# EAGLE design BPM7004_RetroCade_Synth_MegaWing (EAGLE 6.3)
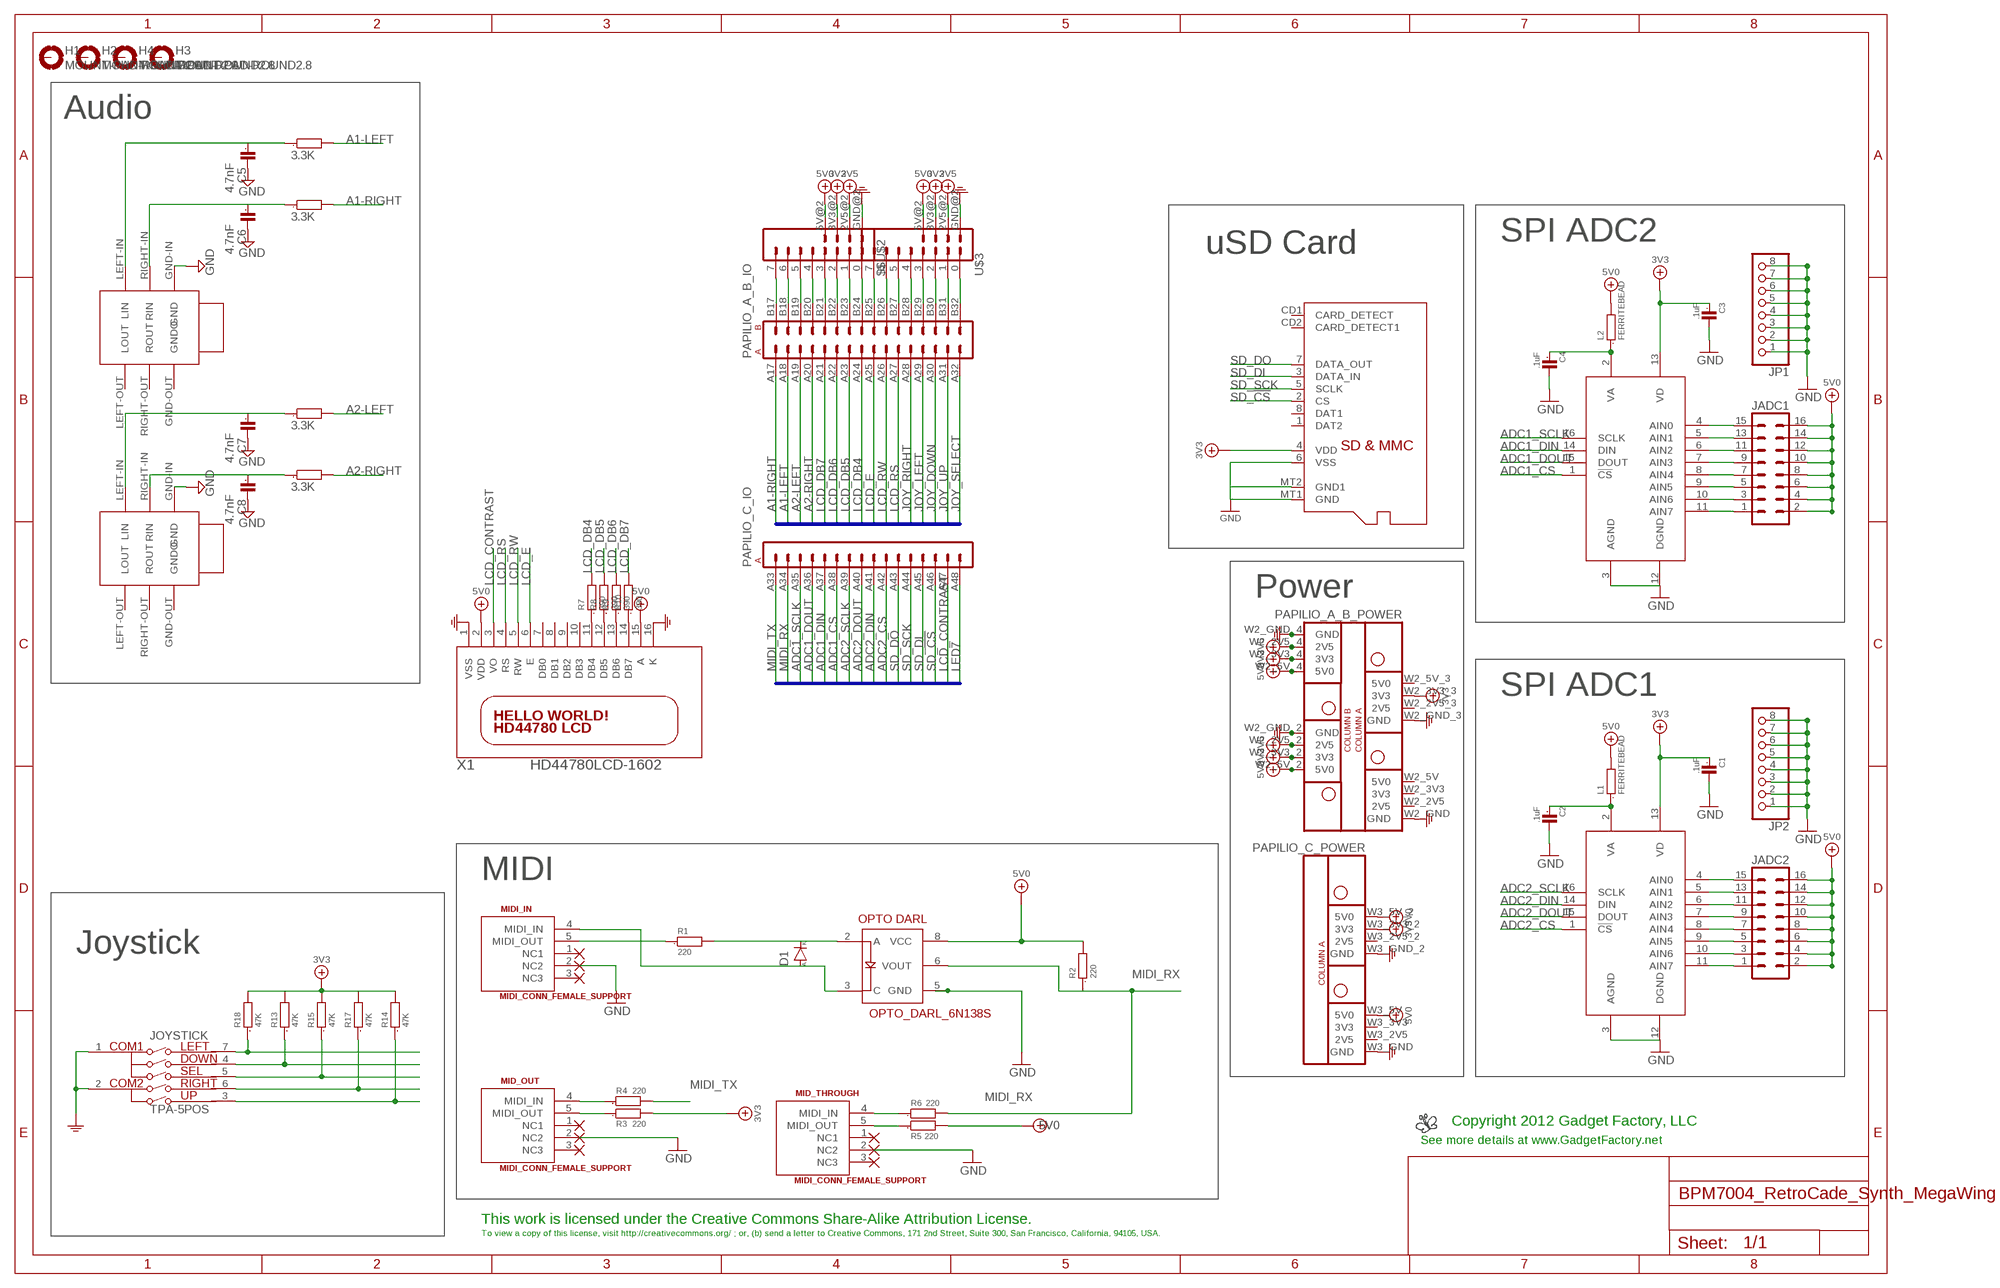
[diagram p0: schematic, sheet 1]

## Parts
$$U$1  OPTO_DARL_6N138S  [8-SMD]
$$U$2  WING8WING8_NOHOLES  [WINGSIDE_8BIT_NOHOLES]
A1  NMJ6HFD2  [NMJ6HFD2]
A2  NMJ6HFD2  [NMJ6HFD2]
ADC1  ADC088S102CIMT  [TSSOP16]
ADC2  ADC088S102CIMT  [TSSOP16]
C1  .1uF  C0603  [0603]
C2  .1uF  C0603  [0603]
C3  .1uF  C0603  [0603]
C4  .1uF  C0603  [0603]
C5  4.7nF  C0603  [0603]
C6  4.7nF  C0603  [0603]
C7  4.7nF  C0603  [0603]
C8  4.7nF  C0603  [0603]
D1  DIODE_SOD323  [SOD323]
H1  MOUNT-PAD-ROUND2.8  [2,8-PAD]
H2  MOUNT-PAD-ROUND2.8  [2,8-PAD]
H3  MOUNT-PAD-ROUND2.8  [2,8-PAD]
H4  MOUNT-PAD-ROUND2.8  [2,8-PAD]
JADC1  MA08-2  [MA08-2]
JADC2  MA08-2  [MA08-2]
JOYSTICK  TPA-5POS  [TPA-5POS]
JP1  PINHD-1X8  [1X08]
JP2  PINHD-1X8  [1X08]
L1  FERRITEBEAD  R0603  [0603]
L2  FERRITEBEAD  R0603  [0603]
LOGO1  BUTTERFLY_LOGO  [BUTTERFLY_LOGO]
MID_OUT  MIDI_CONN_FEMALE_SUPPORT  [DIN_5_FEMALE_SUPPORT]
MID_THROUGH  MIDI_CONN_FEMALE_SUPPORT  [DIN_5_FEMALE_SUPPORT]
MIDI_IN  MIDI_CONN_FEMALE_SUPPORT  [DIN_5_FEMALE_SUPPORT]
PAPILIO_  MEGAWING_FULL_P1MEGAWING_P1  [MEGAWING_FULL_NOHOLES_P1]
R1  220  R0603  [0603]
R2  220  R0603  [0603]
R3  220  R0603  [0603]
R4  220  R0603  [0603]
R5  220  R0603  [0603]
R6  220  R0603  [0603]
R7  390  R0603  [0603]
R8  390  R0603  [0603]
R9  390  R0603  [0603]
R10  390  R0603  [0603]
R11  3.3K  R0603  [0603]
R12  3.3K  R0603  [0603]
R13  47K  R0603  [0603]
R14  47K  R0603  [0603]
R15  47K  R0603  [0603]
R16  3.3K  R0603  [0603]
R17  47K  R0603  [0603]
R18  47K  R0603  [0603]
R19  3.3K  R0603  [0603]
SD1  MICROSD  [MICROSD]
U$3  WING8WING8_NOHOLES  [WINGSIDE_8BIT_NOHOLES]
X1  HD44780LCD-1602  [LCD1602]

## Nets
3V3: ADC1.13(VD) ADC2.13(VD) C1.1 C3.1 PAPILIO_.W2_3V3_3(A_B_POWER:3V3) PAPILIO_.W3_3V3_2(C_POWER:3V3) R3.2 R13.2 R14.2 R15.2 R17.2 R18.2 SD1.4(VDD)
5V0: $$U$1.8(VCC) JADC1.2 JADC1.4 JADC1.6 JADC1.8 JADC1.10 JADC1.12 JADC1.14 JADC1.16 JADC2.2 JADC2.4 JADC2.6 JADC2.8 JADC2.10 JADC2.12 JADC2.14 JADC2.16 L1.2 L2.2 PAPILIO_.W3_5V(C_POWER:5V0) PAPILIO_.W3_5V_2(C_POWER:5V0) R2.2 R5.2 X1.2(VDD) X1.15(A)
A1-LEFT: PAPILIO_.A18(A_B_IO:A2) R11.2
A1-RIGHT: PAPILIO_.A17(A_B_IO:A1) R12.2
A2-LEFT: PAPILIO_.A19(A_B_IO:A3) R16.2
A2-RIGHT: PAPILIO_.A20(A_B_IO:A4) R19.2
ADC1_CS: ADC2.1(!CS) PAPILIO_.A38(C_IO:A6)
ADC1_DIN: ADC2.14(DIN) PAPILIO_.A37(C_IO:A5)
ADC1_DOUT: ADC2.15(DOUT) PAPILIO_.A36(C_IO:A4)
ADC1_SCLK: ADC2.16(SCLK) PAPILIO_.A35(C_IO:A3)
ADC2_CS: ADC1.1(!CS) PAPILIO_.A42(C_IO:A10)
ADC2_DIN: ADC1.14(DIN) PAPILIO_.A41(C_IO:A9)
ADC2_DOUT: ADC1.15(DOUT) PAPILIO_.A40(C_IO:A8)
ADC2_SCLK: ADC1.16(SCLK) PAPILIO_.A39(C_IO:A7)
GND: $$U$1.5(GND) A1.GND-IN(GND) A2.GND-IN(GND) ADC1.3(AGND) ADC1.12(DGND) ADC2.3(AGND) ADC2.12(DGND) C1.2 C2.2 C3.2 C4.2 C5.2 C6.2 C7.2 C8.2 JOYSTICK.1(COM1) JOYSTICK.2(COM2) JP1.1 JP1.2 JP1.3 JP1.4 JP1.5 JP1.6 JP1.7 JP1.8 JP2.1 JP2.2 JP2.3 JP2.4 JP2.5 JP2.6 JP2.7 JP2.8 MID_OUT.2(NC2) MID_THROUGH.2(NC2) MIDI_IN.2(NC2) PAPILIO_.W2_GND(A_B_POWER:GND) PAPILIO_.W2_GND_3(A_B_POWER:GND) PAPILIO_.W3_GND(C_POWER:GND) PAPILIO_.W3_GND_2(C_POWER:GND) SD1.6(VSS) SD1.MT1(GND) SD1.MT2(GND1) X1.1(VSS) X1.16(K) ; supply symbol labelled AGND
JOY_DOWN: JOYSTICK.4(DOWN) PAPILIO_.A30(A_B_IO:A14) R13.1
JOY_LEFT: JOYSTICK.7(LEFT) PAPILIO_.A29(A_B_IO:A13) R18.1
JOY_RIGHT: JOYSTICK.6(RIGHT) PAPILIO_.A28(A_B_IO:A12) R17.1
JOY_SELECT: JOYSTICK.5(SELECT) PAPILIO_.A32(A_B_IO:A16) R15.1
JOY_UP: JOYSTICK.3(UP) PAPILIO_.A31(A_B_IO:A15) R14.1
LCD_CONTRAST: PAPILIO_.A47(C_IO:A15) X1.3(VO)
LCD_DB4: PAPILIO_.A24(A_B_IO:A8) R7.2
LCD_DB5: PAPILIO_.A23(A_B_IO:A7) R8.2
LCD_DB6: PAPILIO_.A22(A_B_IO:A6) R9.2
LCD_DB7: PAPILIO_.A21(A_B_IO:A5) R10.2
LCD_E: PAPILIO_.A25(A_B_IO:A9) X1.6(E)
LCD_RS: PAPILIO_.A27(A_B_IO:A11) X1.4(RS)
LCD_RW: PAPILIO_.A26(A_B_IO:A10) X1.5(RW)
LED7: PAPILIO_.A48(C_IO:A16)
MIDI_RX: $$U$1.6(VOUT) PAPILIO_.A34(C_IO:A2) R2.1 R6.2
MIDI_TX: PAPILIO_.A33(C_IO:A1) R4.2
N$1: MIDI_IN.5(MIDI_OUT) R1.1
N$2: $$U$1.3(C) D1.A MIDI_IN.4(MIDI_IN)
N$3: $$U$1.2(A) D1.K R1.2
N$4: A1.RIGHT-IN(RIN) C6.1 R12.1
N$5: MID_OUT.4(MIDI_IN) R4.1
N$6: ADC2.2(VA) C4.1 L2.1
N$7: MID_OUT.5(MIDI_OUT) R3.1
N$8: ADC2.11(AIN7) JADC1.1
N$9: ADC2.10(AIN6) JADC1.3
N$10: ADC2.9(AIN5) JADC1.5
N$11: ADC2.8(AIN4) JADC1.7
N$12: ADC2.7(AIN3) JADC1.9
N$13: ADC2.6(AIN2) JADC1.11
N$14: ADC2.5(AIN1) JADC1.13
N$15: ADC2.4(AIN0) JADC1.15
N$16: A1.LEFT-IN(LIN) C5.1 R11.1
N$17: A2.RIGHT-IN(RIN) C8.1 R19.1
N$18: A2.LEFT-IN(LIN) C7.1 R16.1
N$19: MID_THROUGH.4(MIDI_IN) R6.1
N$20: MID_THROUGH.5(MIDI_OUT) R5.1
N$24: R7.1 X1.11(DB4)
N$25: R8.1 X1.12(DB5)
N$26: R9.1 X1.13(DB6)
N$27: R10.1 X1.14(DB7)
N$37: ADC1.2(VA) C2.1 L1.1
N$39: ADC1.11(AIN7) JADC2.1
N$40: ADC1.10(AIN6) JADC2.3
N$41: ADC1.9(AIN5) JADC2.5
N$42: ADC1.8(AIN4) JADC2.7
N$43: ADC1.7(AIN3) JADC2.9
N$44: ADC1.6(AIN2) JADC2.11
N$45: ADC1.5(AIN1) JADC2.13
N$46: ADC1.4(AIN0) JADC2.15
N$160: $$U$2.7 PAPILIO_.B17(A_B_IO:B1)
N$161: $$U$2.6 PAPILIO_.B18(A_B_IO:B2)
N$162: $$U$2.5 PAPILIO_.B19(A_B_IO:B3)
N$163: $$U$2.4 PAPILIO_.B20(A_B_IO:B4)
N$164: $$U$2.3 PAPILIO_.B21(A_B_IO:B5)
N$165: $$U$2.2 PAPILIO_.B22(A_B_IO:B6)
N$166: $$U$2.1 PAPILIO_.B23(A_B_IO:B7)
N$167: $$U$2.0 PAPILIO_.B24(A_B_IO:B8)
N$168: PAPILIO_.B25(A_B_IO:B9) U$3.7
N$169: PAPILIO_.B26(A_B_IO:B10) U$3.6
N$170: PAPILIO_.B27(A_B_IO:B11) U$3.5
N$171: PAPILIO_.B28(A_B_IO:B12) U$3.4
N$172: PAPILIO_.B29(A_B_IO:B13) U$3.3
N$173: PAPILIO_.B30(A_B_IO:B14) U$3.2
N$174: PAPILIO_.B31(A_B_IO:B15) U$3.1
N$175: PAPILIO_.B32(A_B_IO:B16) U$3.0
SD_!CS: PAPILIO_.A46(C_IO:A14) SD1.2(CS)
SD_DI: PAPILIO_.A45(C_IO:A13) SD1.3(DATA_IN)
SD_DO: PAPILIO_.A43(C_IO:A11) SD1.7(DATA_OUT)
SD_SCK: PAPILIO_.A44(C_IO:A12) SD1.5(SCLK)
WS2_2V5: PAPILIO_.W2_2V5_4(A_B_POWER:2V5) U$3.2V5@2(2V5) ; supply symbol labelled 2V5
WS2_3V3: PAPILIO_.W2_3V3_4(A_B_POWER:3V3) U$3.3V3@2(3V3) ; supply symbol labelled 3V3
WS2_5V0: PAPILIO_.W2_5V_4(A_B_POWER:5V0) U$3.5V@2(5V) ; supply symbol labelled 5V0
WS2_GND: PAPILIO_.W2_GND_4(A_B_POWER:GND) U$3.GND@2(GND) ; supply symbol labelled AGND
WS_2V5: $$U$2.2V5@2(2V5) PAPILIO_.W2_2V5_2(A_B_POWER:2V5) ; supply symbol labelled 2V5
WS_3V3: $$U$2.3V3@2(3V3) PAPILIO_.W2_3V3_2(A_B_POWER:3V3) ; supply symbol labelled 3V3
WS_5V0: $$U$2.5V@2(5V) PAPILIO_.W2_5V_2(A_B_POWER:5V0) ; supply symbol labelled 5V0
WS_GND: $$U$2.GND@2(GND) PAPILIO_.W2_GND_2(A_B_POWER:GND) ; supply symbol labelled AGND
Unconnected: A1.GND-OUT(GNDO) A1.LEFT-OUT(LOUT) A1.RIGHT-OUT(ROUT) A2.GND-OUT(GNDO) A2.LEFT-OUT(LOUT) A2.RIGHT-OUT(ROUT) H1.B2,8(MOUNT) H2.B2,8(MOUNT) H3.B2,8(MOUNT) H4.B2,8(MOUNT) MID_OUT.1(NC1) MID_OUT.3(NC3) MID_THROUGH.1(NC1) MID_THROUGH.3(NC3) MIDI_IN.1(NC1) MIDI_IN.3(NC3) PAPILIO_.W2_2V5(A_B_POWER:2V5) PAPILIO_.W2_2V5_3(A_B_POWER:2V5) PAPILIO_.W2_3V3(A_B_POWER:3V3) PAPILIO_.W2_5V(A_B_POWER:5V0) PAPILIO_.W2_5V_3(A_B_POWER:5V0) PAPILIO_.W3_2V5(C_POWER:2V5) PAPILIO_.W3_2V5_2(C_POWER:2V5) PAPILIO_.W3_3V3(C_POWER:3V3) SD1.1(DAT2) SD1.8(DAT1) SD1.CD1(CARD_DETECT) SD1.CD2(CARD_DETECT1) X1.7(DB0) X1.8(DB1) X1.9(DB2) X1.10(DB3)

## Buses
SW[0..7],LED[0..7]
RED[0..2],GREEN[0..2],BLUE[0..1],VERTICAL_SYNC,HORIZONTAL_SYNC,AUDIO,SPI_SCLK,SPI_DIN,SPI_DOUT,SPI_CS,JOY_SELECT,JOY_RIGHT,JOY_LEFT,JOY_DOWN,JOY_UP,AN[0..3],A,B,C,D,E,F,G,DP

## Notes on the sheet
- Audio
- SPI ADC2
- uSD Card
- Power
- SPI ADC1
- MIDI
- Joystick
- Copyright 2012 Gadget Factory, LLC
- See more details at www.GadgetFactory.net
- This work is licensed under the Creative Commons Share-Alike Attribution License.
- To view a copy of this license, visit http://creativecommons.org/ ; or, (b) send a letter to Creative Commons, 171 2nd Street, Suite 300, San Francisco, California, 94105, USA.

## Library data of the parts
$$U$1 = SparkFun:OPTO_DARL_6N138S
$$U$2 U$3 = Papilio:WING8
A1 A2 = Neutrik:NMJ6HFD2
ADC1 ADC2 = spiadc:ADC088S102
C1-C8 = GadgetFactory:C: CAPACITOR, European symbol
D1 = GadgetFactory:DIODE
H1-H4 = holes:MOUNT-PAD-ROUND: MOUNTING PAD, round
JADC1 JADC2 = con-lstb:MA08-2: PIN HEADER
JOYSTICK = proxmark:TPA-5POS: Navigation switch, 4 directions with select Digikey part: 401-1130-1-ND
JP1 JP2 = GadgetFactory:PINHD-1X8: PIN HEADER
L1 L2 R1-R12 R16 R19 = GadgetFactory:R: RESISTOR, European symbol
LOGO1 = GadgetFactory_Pub:BUTTERFLY_LOGO
MID_OUT MID_THROUGH MIDI_IN = GadgetFactory:MIDI_CONN_FEMALE_SUPPORT
PAPILIO_ = Papilio:MEGAWING_FULL_P1
R13-R15 R17 R18 = GadgetFactory:R: RESISTOR, European symbol; DIGIKEY#: 311-390GRCT-ND
SD1 = adafruit:MICROSD: Micro-SD / Transflash card holder with SPI pinout For the 3M # 2908-05WB-MG and/or 4UCON #19656 push-push type
X1 = adafruit:HD44780LCD: HD44780 LCD Standard character type LCDs, available in sizes from 8x1 to 40x4!

## Board
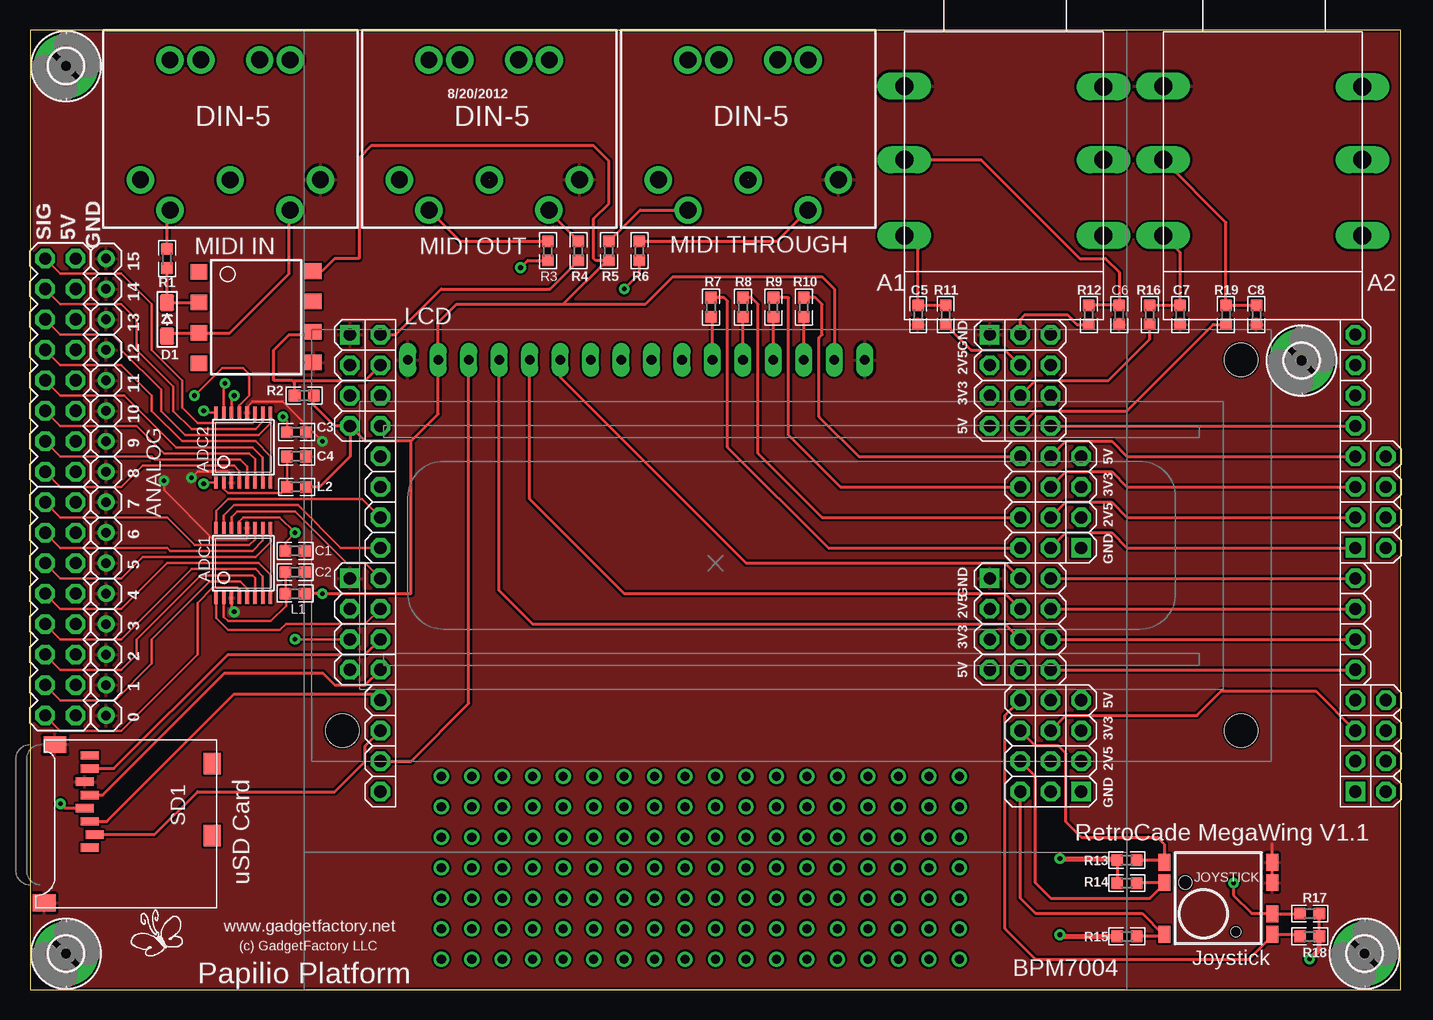
[diagram p1: board, top side]
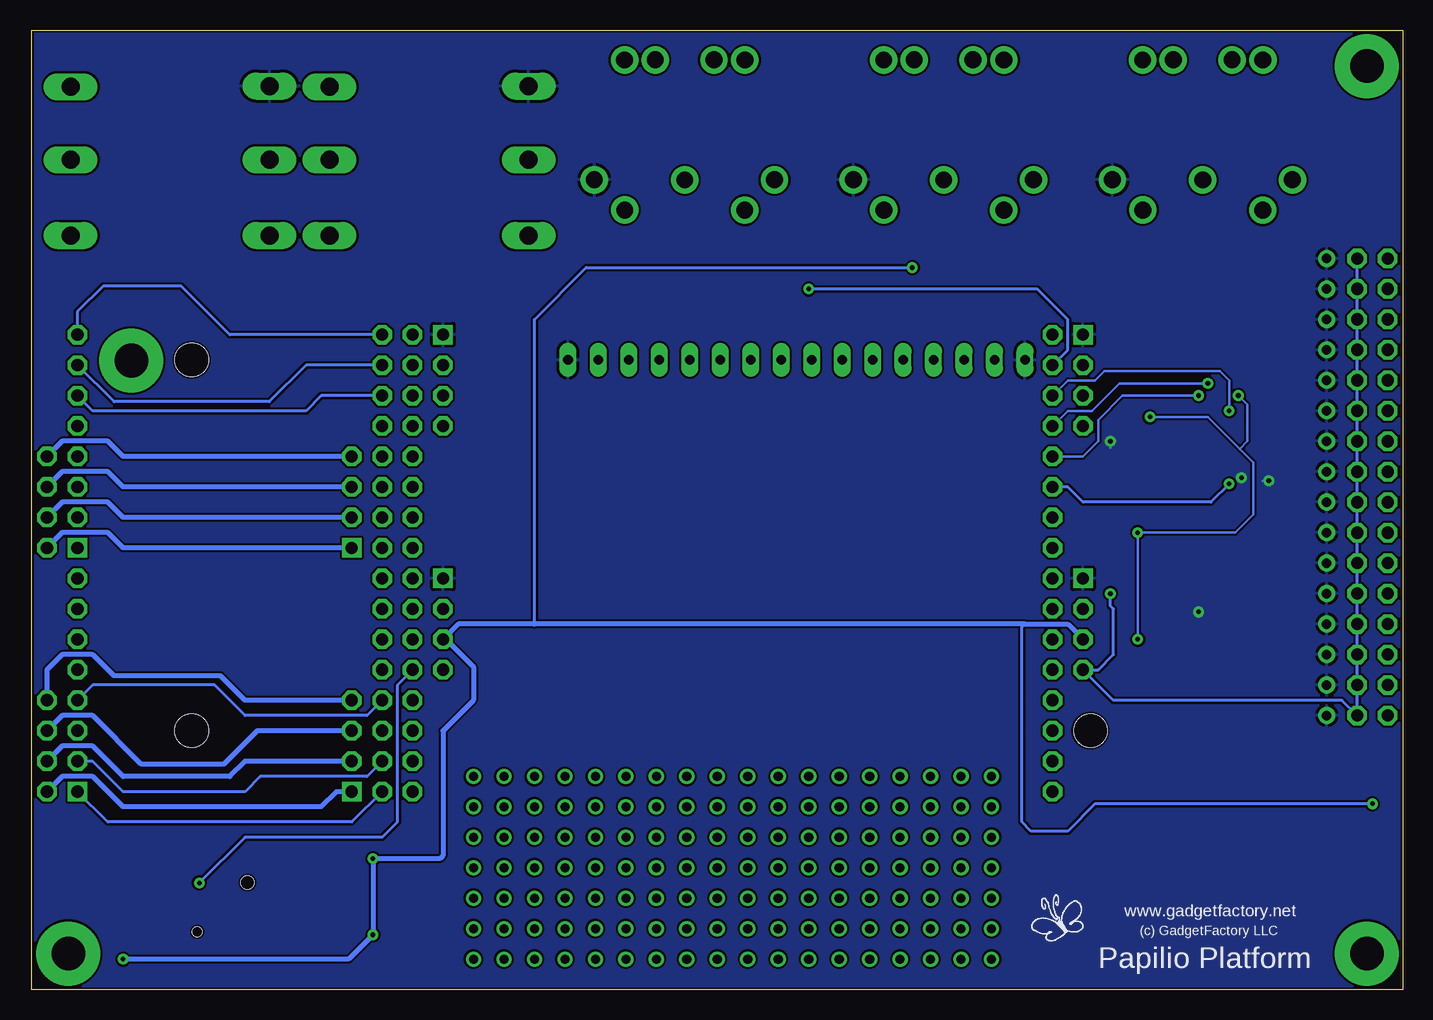
[diagram p2: board, bottom side, seen from below]

Size 114.29 x 80.01 mm. Coordinates in mm from the lower left corner, seen from the top.
Outline: 0,80.01 0,0 114.29,0 114.29,80.01 0,80.01
Copper layers (1*16): Top 0.035mm / dielectric 1.5mm / Bottom 0.035mm
Design rules "SparkFun_Derived_GoldePheonix_7mil *": minimum track width 7mil, minimum drill 15mil, track to track 7mil, track to pad 7mil, pad to pad 7mil, via to via 7mil, smd to smd 7mil, copper to edge 7mil, drill to drill 7mil, minimum pad ring 12mil, minimum via ring 10mil, stop-mask expansion 4mil, vias tented up to drill 18mil, thermal gap 10mil

### Footprints (pad centres in the part's own frame; a part is rotated, then mirrored left to right if it is on the bottom)
8-SMD = smd 1.3 x 1.4: 1 -3.96,-4.96; 2 -1.42,-4.96; 3 1.12,-4.96; 4 3.66,-4.96; 5 3.59,4.58; 6 1.05,4.58; 7 -1.49,4.58; 8 -4.03,4.58
WINGSIDE_8BIT_NOHOLES = drill 1.016 square: 0 19.05,1.27 | drill 1.016 octagon: 1 16.51,1.27; 2 13.97,1.27; 2V5@2 16.51,3.81; 3 11.43,1.27; 3V3@2 13.97,3.81; 4 8.89,1.27; 5 6.35,1.27; 5V@2 11.43,3.81; 6 3.81,1.27; 7 1.27,1.27; GND@2 19.05,3.81
NMJ6HFD2 = drill 1.5 long: GND-IN -8.4,19.45; GND-OUT 8.2,19.4; LEFT-IN -8.4,7; LEFT-OUT 8.2,7; RIGHT-IN -8.4,13.3; RIGHT-OUT 8.2,13.3
TSSOP16 = smd 0.305 x 0.991: 1 -2.275,-2.918; 2 -1.625,-2.918; 3 -0.975,-2.918; 4 -0.325,-2.918; 5 0.325,-2.918; 6 0.975,-2.918; 7 1.625,-2.918; 8 2.275,-2.918; 9 2.275,2.918; 10 1.625,2.918; 11 0.975,2.918; 12 0.325,2.918; 13 -0.325,2.918; 14 -0.975,2.918; 15 -1.625,2.918; 16 -2.275,2.918
0603 = smd 1 x 1: 1 -0.8,0; 2 0.8,0
SOD323 = smd 1.4 x 1.2: A 1.4,0; K -1.4,0
2,8-PAD = drill 2.8 pad 5.334 round: B2,8 0,0
MA08-2 = drill 1.016 octagon: 1 -8.89,-1.27; 2 -8.89,1.27; 3 -6.35,-1.27; 4 -6.35,1.27; 5 -3.81,-1.27; 6 -3.81,1.27; 7 -1.27,-1.27; 8 -1.27,1.27; 9 1.27,-1.27; 10 1.27,1.27; 11 3.81,-1.27; 12 3.81,1.27; 13 6.35,-1.27; 14 6.35,1.27; 15 8.89,-1.27; 16 8.89,1.27
TPA-5POS = smd 1 x 1.4: 1 -4.5,-3; 2 -4.5,-1.3; 3 4.5,-1.3; 4 4.5,-3; 5 4.5,3; 6 -4.5,1.3; 7 -4.5,3 | hole 0.8: -1.45,2.8 | hole 1.1: 2.75,-1.3
1X08 = drill 0.8 round: 1 -8.89,0; 2 -6.35,0; 3 -3.81,0; 4 -1.27,0; 5 1.27,0; 6 3.81,0; 7 6.35,0; 8 8.89,0
DIN_5_FEMALE_SUPPORT = drill 1.4 pad 2.286 round: 1 0.46,3.61; 2 -7.07,3.6; 3 7.94,3.6; 4 -4.53,6.12; 5 5.47,6.13; 6 -2,-6.4; 7 2.9,-6.4; 8 5.478,-6.382; 9 -4.55,-6.382
MEGAWING_FULL_NOHOLES_P1 = drill 1.016 octagon: A17 59.69,43.18; A18 59.69,40.64; A19 59.69,38.1; A20 59.69,35.56; A21 59.69,33.02; A22 59.69,30.48; A23 59.69,27.94; A24 59.69,25.4; A25 59.69,22.86; A26 59.69,20.32; A27 59.69,17.78; A28 59.69,15.24; A29 59.69,12.7; A30 59.69,10.16; A31 59.69,7.62; A32 59.69,5.08; A33 6.35,43.18; A34 6.35,40.64; A35 6.35,38.1; A36 6.35,35.56; A37 6.35,33.02; A38 6.35,30.48; A39 6.35,27.94; A40 6.35,25.4; A41 6.35,22.86; A42 6.35,20.32; A43 6.35,17.78; A44 6.35,15.24; A45 6.35,12.7; A46 6.35,10.16; A47 6.35,7.62; A48 6.35,5.08; B17 62.23,43.18; B18 62.23,40.64; B19 62.23,38.1; B20 62.23,35.56; B21 62.23,33.02; B22 62.23,30.48; B23 62.23,27.94; B24 62.23,25.4; B25 62.23,22.86; B26 62.23,20.32; B27 62.23,17.78; B28 62.23,15.24; B29 62.23,12.7; B30 62.23,10.16; B31 62.23,7.62; B32 62.23,5.08; W2_2V5 57.15,40.64; W2_2V5_2 64.77,27.94; W2_2V5_3 57.15,20.32; W2_2V5_4 64.77,7.62; W2_3V3 57.15,38.1; W2_3V3_2 64.77,30.48; W2_3V3_3 57.15,17.78; W2_3V3_4 64.77,10.16; W2_5V 57.15,35.56; W2_5V_2 64.77,33.02; W2_5V_3 57.15,15.24; W2_5V_4 64.77,12.7; W3_2V5 3.81,40.64; W3_2V5_2 3.81,20.32; W3_3V3 3.81,38.1; W3_3V3_2 3.81,17.78; W3_5V 3.81,35.56; W3_5V_2 3.81,15.24 | drill 1.016 square: W2_GND 57.15,43.18; W2_GND_2 64.77,25.4; W2_GND_3 57.15,22.86; W2_GND_4 64.77,5.08; W3_GND 3.81,43.18; W3_GND_2 3.81,22.86
MICROSD = smd 0.7 x 1.5: 1 9,-10.64; 2 7.9,-10.24; 3 6.8,-10.64; 4 5.7,-11.04; 5 4.6,-10.64; 6 3.5,-11.04; 7 2.4,-10.64; 8 1.3,-10.64 | smd 1.8 x 1.4: CD1 2,-0.44; CD2 8,-0.44 | smd 1.4 x 1.9: MT1 0.4,-13.54; MT2 13.6,-14.44
LCD1602 = drill 0.8 long: 1 8,33.46; 2 10.54,33.46; 3 13.08,33.46; 4 15.62,33.46; 5 18.16,33.46; 6 20.7,33.46; 7 23.24,33.46; 8 25.78,33.46; 9 28.32,33.46; 10 30.86,33.46; 11 33.4,33.46; 12 35.94,33.46; 13 38.48,33.46; 14 41.02,33.46; 15 43.56,33.46; 16 46.1,33.46 | hole 2.8: 2.54,2.54; 77.46,33.46; 77.46,2.54

### Placement (x,y rotation side)
$$U$1  19.05,55.88 270 top
$$U$2  109.22,55.88 270 top
A1  81.28,55.88 0 top
A2  102.87,55.88 0 top
ADC1  17.78,35.56 0 top
ADC2  17.78,45.21 0 top
C1  22.1,36.58 0 top
C2  22.1,34.8 0 top
C3  22.23,46.48 0 top
C4  22.23,44.45 0 top
C5  74.04,56.26 270 top
C6  90.81,56.26 270 top
C7  95.89,56.26 270 top
C8  102.23,56.26 270 top
D1  11.43,55.88 270 top
H1  3,77 0 top
H2  3,3 0 top
H3  106,52.45 0 top
H4  111.25,3 0 top
JADC1  2.54,52.07 270 top
JADC2  2.54,31.75 270 top
JOYSTICK  99.06,7.62 180 top
JP1  6.35,31.75 90 top
JP2  6.35,52.07 90 top
L1  22.1,33.02 0 top
L2  22.23,41.91 0 top
LOGO1  10.67,4.19 0 top
LOGO2  BUTTERFLY_LOGO  [BUTTERFLY_LOGO]  28.7,5.46 0 bottom
MID_OUT  38.73,71.12 180 top
MID_THROUGH  60.33,71.12 180 top
MIDI_IN  17.14,71.12 180 top
PAPILIO_  22.86,11.43 0 top
R1  11.43,60.96 270 top
R2  22.86,49.53 0 top
R3  43.18,61.59 270 top
R4  45.72,61.59 270 top
R5  48.26,61.59 270 top
R6  50.8,61.59 270 top
R7  56.77,56.9 90 top
R8  59.44,56.9 90 top
R9  61.98,56.9 90 top
R10  64.52,56.9 90 top
R11  76.33,56.26 270 top
R12  88.27,56.26 270 top
R13  91.44,10.79 180 top
R14  91.44,8.89 180 top
R15  91.44,4.45 180 top
R16  93.34,56.26 270 top
R17  106.68,6.35 0 top
R18  106.68,4.45 0 top
R19  99.69,56.26 270 top
SD1  15.62,20.83 270 top
U$3  109.22,35.56 270 top
X1  23.5,19.05 0 top

### Tracks (layer width: path | path; a pad name or v marks a point on that pad's centre or on a via)
3V3  (via drill 0.38)
  Top 0.203: ADC2.13 17.45,48.7 18.29,49.53 18.29,51.31 17.78,51.82 16,51.82 v13.72,49.53 | C3.1 21.43,47.41 v21.08,47.75 | PAPILIO_.W3_3V3_2 v22.1,29.21 | C1.1 21.3,37.3 v22.1,38.1 20.83,39.37 17.78,39.37 17.45,39.05 ADC1.13
  Top 0.254: R13.2 R14.2 | R18.2 R17.2 | SD1.4 2.91,15.13 v2.54,15.49 | R3.2 41.49,60.8 v40.89,60.2
  Top 0.406: v85.85,10.92 90.51,10.92 R13.2 | R15.2 85.98,4.45 v85.85,4.57 | R18.2 107.48,3.34 v106.68,2.54
  Bottom 0.203: v21.08,47.75 16.26,47.75 13.59,45.09 | 13.59,45.09 12.45,43.94 12.45,39.62 13.97,38.1 v22.1,38.1 v22.1,29.21 | 13.59,45.09 12.95,45.72 12.95,48.77 v13.72,49.53
  Bottom 0.254: v2.54,15.49 25.65,15.49 27.94,13.21 30.99,13.21 31.75,13.97 31.75,30.23 31.5,30.48 | v40.89,60.2 68.07,60.2 72.39,55.88 72.39,30.48
  Bottom 0.406: PAPILIO_.W3_3V3_2 27.94,30.48 31.5,30.48 72.39,30.48 78.74,30.48 PAPILIO_.W2_3V3_3 79.76,29.21 77.47,26.92 77.47,24.13 80.01,21.59 80.01,11.18 80.26,10.92 v85.85,10.92 v85.85,4.57 87.88,2.54 v106.68,2.54
5V0  (via drill 0.38)
  Top 0.254: 44.45,57.15 48.09,60.8 R5.2 47.16,60.8 46.99,60.96 46.99,64.26 48.26,65.53 48.26,69.09 46.99,70.36 28.45,70.36 27.43,69.34 27.43,60.96 25.4,60.96 24.35,59.91 $$U$1.8 | 44.45,57.15 35.56,57.15 34.03,55.62 X1.2 34.03,48.01 31.75,45.72 | PAPILIO_.W3_5V 25.4,46.99 23.66,48.73 R2.2 | PAPILIO_.W3_5V 27.94,45.72 31.75,45.72 | L1.2 v24.38,33.02 31.75,33.02 31.75,45.72 | L2.2 24.13,41.91 26.67,44.45 PAPILIO_.W3_5V | X1.15 67.06,58.42 66.04,59.44 53.59,59.44 51.31,57.15 44.45,57.15
  Bottom 0.254: v24.38,33.02 24.38,32 24.13,31.75 24.13,27.94 25.4,26.67 PAPILIO_.W3_5V_2 24.13,24.13 5.08,24.13 JADC2.16 JADC2.14 JADC2.12 JADC2.10 JADC2.8 JADC2.6 JADC2.4 JADC2.2 JADC1.16 JADC1.14 JADC1.12 JADC1.10 JADC1.8 JADC1.6 JADC1.4 JADC1.2
A1-LEFT
  Top 0.254: PAPILIO_.A18 81.28,53.34 78.45,53.34 R11.2
A1-RIGHT
  Top 0.254: PAPILIO_.A17 82.55,55.88 82.93,56.26 86.49,56.26 87.29,55.46 R12.2
A2-LEFT
  Top 0.254: PAPILIO_.A19 83.82,50.8 89.92,50.8 93.34,54.23 R16.2
A2-RIGHT
  Top 0.254: PAPILIO_.A20 83.82,48.26 91.44,48.26 98.64,55.46 R19.2
ADC1_CS  (via drill 0.38)
  Top 0.203: ADC2.1 14.61,42.29 v14.48,42.16
  Bottom 0.254: PAPILIO_.A38 27.94,41.91 26.67,40.64 16,40.64 v14.48,42.16
ADC1_DIN  (via drill 0.38)
  Top 0.203: ADC2.14 16.8,49.32 v17.02,49.53
  Bottom 0.203: PAPILIO_.A37 26.67,44.45 25.4,45.72 25.4,47.5 23.37,49.53 v17.02,49.53
ADC1_DOUT  (via drill 0.38)
  Top 0.203: ADC2.15 16.16,50.45 v16.26,50.55
  Bottom 0.203: PAPILIO_.A36 27.94,48.26 25.91,48.26 23.62,50.55 v16.26,50.55
ADC1_SCLK  (via drill 0.38)
  Top 0.203: ADC2.16 14.61,48.13 v14.48,48.26
  Bottom 0.203: v14.48,48.26 14.48,50.8 15.24,51.56 24.89,51.56 25.65,50.8 27.94,50.8 PAPILIO_.A35
ADC2_CS
  Top 0.203: ADC1.1 15.51,30.98 16.51,29.97 20.83,29.97 21.34,30.48 27.94,30.48 PAPILIO_.A42
ADC2_DIN
  Top 0.203: ADC1.14 16.8,39.41 17.27,39.88 22.1,39.88 26.42,35.56 27.94,35.56 PAPILIO_.A41
ADC2_DOUT
  Top 0.203: ADC1.15 16.16,39.52 17.02,40.39 22.35,40.39 25.91,36.83 PAPILIO_.A40
ADC2_SCLK
  Top 0.203: ADC1.16 15.51,39.89 16.51,40.89 27.69,40.89 PAPILIO_.A39
GND  (via drill 0.38)
  Top 0.203: v24.38,45.72 23.62,46.48 C3.2 22.86,46.65 22.86,47.24 21.08,49.02 18.54,49.02 18.11,48.59 ADC2.12 | ADC2.3 16.8,42.88 16.51,43.18 13.97,43.18 v13.46,42.67 | ADC1.12 18.11,37.66 18.03,37.59 15.24,37.59 11.18,41.66 v11.18,42.42 | ADC1.3 16.8,31.71 v17.02,31.5
  Top 0.254: JOYSTICK.2 JOYSTICK.1 103.56,12.12
  Bottom 0.203: v24.38,45.72 24.38,45.21 | v11.18,42.42 11.68,42.42 | v17.02,31.5 17.27,31.75
  pour Bottom: 0,80.01 0,0 114.3,0 114.3,80.01
  pour Top: 0,80.01 0,0 114.3,0 114.3,80.01
JOY_DOWN
  Top 0.254: PAPILIO_.A30 83.82,20.32 85.72,20.32 86.36,19.68 86.36,13.97 87.63,12.7 93.98,12.7 94.56,12.12 JOYSTICK.4 94.39,10.79 R13.1
JOY_LEFT
  Top 0.254: PAPILIO_.A29 81.28,22.86 81.28,5.08 83.82,2.54 101.6,2.54 103.56,4.5 JOYSTICK.7 105.7,4.62 R18.1
JOY_RIGHT  (via drill 0.38)
  Top 0.254: R17.1 105.85,6.32 JOYSTICK.6 103.53,6.35 101.85,6.35 100.33,7.87 v100.33,8.89
  Bottom 0.254: PAPILIO_.A28 83.82,25.4 83.82,13.97 85.09,12.7 96.52,12.7 v100.33,8.89
JOY_SELECT
  Top 0.254: R15.1 94.39,4.45 JOYSTICK.5 94.44,4.62 92.71,6.35 83.82,6.35 82.55,7.62 PAPILIO_.A32
JOY_UP
  Top 0.254: PAPILIO_.A31 83.82,17.78 83.82,8.89 85.09,7.62 93.34,7.62 94.56,8.84 JOYSTICK.3 94.53,8.89 R14.1
LCD_CONTRAST
  Top 0.254: X1.3 36.58,23.88 31.75,19.05 PAPILIO_.A47
LCD_DB4
  Top 0.254: R7.2 57.87,57.7 58.17,57.4 58.17,45.21 66.55,36.83 PAPILIO_.A24
LCD_DB5
  Top 0.254: R8.2 60.16,57.7 60.71,57.15 60.71,44.7 66.04,39.37 PAPILIO_.A23
LCD_DB6
  Top 0.254: R9.2 63.21,57.7 63.25,57.66 63.25,46.23 67.56,41.91 PAPILIO_.A22
LCD_DB7
  Top 0.254: R10.2 65.49,57.7 66.04,57.15 66.04,54.61 65.79,54.36 65.79,47.75 69.09,44.45 PAPILIO_.A21
LCD_E
  Top 0.254: X1.6 44.2,51.05 59.69,35.56 81.28,35.56 PAPILIO_.A25
LCD_RS
  Top 0.254: X1.4 39.12,33.27 41.91,30.48 81.28,30.48 PAPILIO_.A27
LCD_RW
  Top 0.254: X1.5 41.66,40.9 49.53,33.02 81.28,33.02 PAPILIO_.A26
MIDI_RX  (via drill 0.38)
  Top 0.254: $$U$1.6 23.41,54.61 21.59,54.61 20.32,53.34 20.32,50.8 21.84,50.8 | PAPILIO_.A34 27.94,50.8 21.84,50.8 | R6.2 50.8,59.69 v49.53,58.42 | R2.1 22.06,50.58 21.84,50.8
  Bottom 0.254: v49.53,58.42 30.48,58.42 27.94,55.88 27.94,53.34 PAPILIO_.A34
MIDI_TX
  Top 0.254: PAPILIO_.A33 30.48,54.61 34.29,58.42 43.34,58.42 R4.2
N$1
  Top 0.254: R1.1 11.43,64.75 MIDI_IN.5
N$2
  Top 0.254: D1.A 11.71,54.76 $$U$1.3 16.66,54.76 21.59,59.69 21.59,64.92 MIDI_IN.4
N$3
  Top 0.254: R1.2 D1.K 11.45,57.3 $$U$1.2
N$4
  Top 0.254: R12.1 C6.1 90.81,59.82 89.66,60.96 87.5,60.96 79.28,69.18 A1.RIGHT-IN
N$5
  Top 0.254: MID_OUT.4 43.27,64.85 R4.1
N$6
  Top 0.203: ADC2.2 16.16,41.76 16.51,41.4 20.92,41.4 L2.1 C4.1
N$7
  Top 0.254: R3.1 35.86,62.4 MID_OUT.5
N$8
  Top 0.203: ADC2.11 18.75,47.46 18.54,47.24 13.97,47.24 12.7,48.51 12.7,50.8 10.16,53.34 10.16,57.15 7.62,59.69 2.54,59.69 JADC1.1
N$9
  Top 0.203: ADC2.10 19.41,47.34 18.8,46.74 13.46,46.74 11.94,48.26 11.94,50.29 8.89,53.34 8.89,55.88 7.62,57.15 2.54,57.15 JADC1.3
N$10
  Top 0.203: ADC2.9 20.05,47.23 19.05,46.23 12.95,46.23 10.92,48.26 10.92,50.04 7.62,53.34 7.62,53.85 6.86,54.61 2.54,54.61 JADC1.5
N$11
  Top 0.203: ADC2.8 20.05,44.46 18.8,45.72 12.7,45.72 10.16,48.26 10.16,49.53 7.62,52.07 2.54,52.07 JADC1.7
N$12
  Top 0.203: ADC2.7 19.41,44.35 18.54,45.21 12.19,45.21 7.87,49.53 2.54,49.53 JADC1.9
N$13
  Top 0.203: ADC2.6 18.75,44.24 18.29,44.7 11.18,44.7 8.89,46.99 2.54,46.99 JADC1.11
N$14
  Top 0.203: ADC2.5 18.11,43.62 17.53,44.2 10.41,44.2 10.16,44.45 2.54,44.45 JADC1.13
N$15
  Top 0.203: ADC2.4 17.45,43.25 17.02,43.69 9.4,43.69 7.62,41.91 2.54,41.91 JADC1.15
N$16
  Top 0.254: R11.1 C5.1 74.04,61.72 A1.LEFT-IN
N$17
  Top 0.254: C8.1 R19.1 99.69,63.95 A2.RIGHT-IN
N$18
  Top 0.254: A2.LEFT-IN 95.89,61.47 C7.1 R16.1
N$19
  Top 0.254: R6.1 62.25,62.4 MID_THROUGH.4
N$20
  Top 0.254: MID_THROUGH.5 50.85,64.99 R5.1
N$21  (via drill 0.76)
  other vias: 34.29,12.7
N$22  (via drill 0.76)
  other vias: 34.29,15.24
N$23  (via drill 0.76)
  other vias: 36.83,15.24
N$24
  Top 0.254: X1.11 56.9,55.97 R7.1
N$25
  Top 0.254: X1.12 R8.1
N$26
  Top 0.254: X1.13 R9.1
N$27
  Top 0.254: X1.14 R10.1
N$28  (via drill 0.76)
  other vias: 39.37,15.24
N$29  (via drill 0.76)
  other vias: 41.91,15.24
N$30  (via drill 0.76)
  other vias: 44.45,15.24
N$31  (via drill 0.76)
  other vias: 46.99,15.24
N$32  (via drill 0.76)
  other vias: 49.53,15.24
N$33  (via drill 0.76)
  other vias: 52.07,15.24
N$34  (via drill 0.76)
  other vias: 54.61,15.24
N$35  (via drill 0.76)
  other vias: 57.15,15.24
N$36  (via drill 0.76)
  other vias: 59.69,15.24
N$37
  Top 0.203: C2.1 L1.1 21.34,32.98 21.34,32 20.07,30.73 16.51,30.73 16.16,31.09 ADC1.2
N$38  (via drill 0.76)
  other vias: 62.23,15.24
N$39
  Top 0.203: ADC1.11 18.75,37.55 18.29,37.08 13.72,37.08 11.43,39.37 2.54,39.37 JADC2.1
N$40
  Top 0.203: ADC1.10 19.41,37.44 18.54,36.58 11.68,36.58 11.43,36.83 2.54,36.83 JADC2.3
N$41
  Top 0.203: ADC1.9 20.05,37.33 18.8,36.07 9.4,36.07 7.62,34.29 2.54,34.29 JADC2.5
N$42
  Top 0.203: ADC1.8 20.05,34.55 19.05,35.56 11.43,35.56 7.62,31.75 2.54,31.75 JADC2.7
N$43
  Top 0.203: ADC1.7 19.41,34.44 18.8,35.05 13.46,35.05 7.62,29.21 2.54,29.21 JADC2.9
N$44
  Top 0.203: ADC1.6 18.75,34.33 18.54,34.54 14.22,34.54 8.89,29.21 8.89,27.94 7.62,26.67 2.54,26.67 JADC2.11
N$45
  Top 0.203: ADC1.5 18.11,33.46 17.53,34.04 14.99,34.04 10.16,29.21 10.16,27.18 7.11,24.13 2.54,24.13 JADC2.13
N$46
  Top 0.203: ADC1.4 17.45,33.34 17.27,33.53 15.24,33.53 13.97,32.26 13.97,27.94 7.62,21.59 2.54,21.59 JADC2.15
N$47  (via drill 0.76)
  other vias: 64.77,15.24
N$48  (via drill 0.76)
  other vias: 67.31,15.24
N$49  (via drill 0.76)
  other vias: 69.85,15.24
N$50  (via drill 0.76)
  other vias: 72.39,15.24
N$51  (via drill 0.76)
  other vias: 74.93,15.24
N$52  (via drill 0.76)
  other vias: 77.47,15.24
N$53  (via drill 0.76)
  other vias: 36.83,12.7
N$54  (via drill 0.76)
  other vias: 39.37,12.7
N$55  (via drill 0.76)
  other vias: 41.91,12.7
N$56  (via drill 0.76)
  other vias: 44.45,12.7
N$57  (via drill 0.76)
  other vias: 46.99,12.7
N$58  (via drill 0.76)
  other vias: 49.53,12.7
N$59  (via drill 0.76)
  other vias: 52.07,12.7
N$60  (via drill 0.76)
  other vias: 54.61,12.7
N$61  (via drill 0.76)
  other vias: 57.15,12.7
N$62  (via drill 0.76)
  other vias: 59.69,12.7
N$63  (via drill 0.76)
  other vias: 62.23,12.7
N$64  (via drill 0.76)
  other vias: 64.77,12.7
N$65  (via drill 0.76)
  other vias: 67.31,12.7
N$66  (via drill 0.76)
  other vias: 69.85,12.7
N$67  (via drill 0.76)
  other vias: 72.39,12.7
N$68  (via drill 0.76)
  other vias: 74.93,12.7
N$69  (via drill 0.76)
  other vias: 77.47,12.7
N$70  (via drill 0.76)
  other vias: 34.29,10.16
N$71  (via drill 0.76)
  other vias: 36.83,10.16
N$72  (via drill 0.76)
  other vias: 39.37,10.16
N$73  (via drill 0.76)
  other vias: 41.91,10.16
N$74  (via drill 0.76)
  other vias: 44.45,10.16
N$75  (via drill 0.76)
  other vias: 46.99,10.16
N$76  (via drill 0.76)
  other vias: 49.53,10.16
N$77  (via drill 0.76)
  other vias: 52.07,10.16
N$78  (via drill 0.76)
  other vias: 54.61,10.16
N$79  (via drill 0.76)
  other vias: 57.15,10.16
N$80  (via drill 0.76)
  other vias: 59.69,10.16
N$81  (via drill 0.76)
  other vias: 62.23,10.16
N$82  (via drill 0.76)
  other vias: 64.77,10.16
N$83  (via drill 0.76)
  other vias: 67.31,10.16
N$84  (via drill 0.76)
  other vias: 69.85,10.16
N$85  (via drill 0.76)
  other vias: 72.39,10.16
N$86  (via drill 0.76)
  other vias: 74.93,10.16
N$87  (via drill 0.76)
  other vias: 77.47,10.16
N$88  (via drill 0.76)
  other vias: 34.29,7.62
N$89  (via drill 0.76)
  other vias: 36.83,7.62
N$90  (via drill 0.76)
  other vias: 39.37,7.62
N$91  (via drill 0.76)
  other vias: 41.91,7.62
N$92  (via drill 0.76)
  other vias: 44.45,7.62
N$93  (via drill 0.76)
  other vias: 46.99,7.62
N$94  (via drill 0.76)
  other vias: 49.53,7.62
N$95  (via drill 0.76)
  other vias: 52.07,7.62
N$96  (via drill 0.76)
  other vias: 54.61,7.62
N$97  (via drill 0.76)
  other vias: 57.15,7.62
N$98  (via drill 0.76)
  other vias: 59.69,7.62
N$99  (via drill 0.76)
  other vias: 62.23,7.62
N$100  (via drill 0.76)
  other vias: 64.77,7.62
N$101  (via drill 0.76)
  other vias: 67.31,7.62
N$102  (via drill 0.76)
  other vias: 69.85,7.62
N$103  (via drill 0.76)
  other vias: 72.39,7.62
N$104  (via drill 0.76)
  other vias: 74.93,7.62
N$105  (via drill 0.76)
  other vias: 77.47,7.62
N$106  (via drill 0.76)
  other vias: 34.29,5.08
N$107  (via drill 0.76)
  other vias: 36.83,5.08
N$108  (via drill 0.76)
  other vias: 39.37,5.08
N$109  (via drill 0.76)
  other vias: 41.91,5.08
N$110  (via drill 0.76)
  other vias: 44.45,5.08
N$111  (via drill 0.76)
  other vias: 46.99,5.08
N$112  (via drill 0.76)
  other vias: 49.53,5.08
N$113  (via drill 0.76)
  other vias: 52.07,5.08
N$114  (via drill 0.76)
  other vias: 54.61,5.08
N$115  (via drill 0.76)
  other vias: 57.15,5.08
N$116  (via drill 0.76)
  other vias: 59.69,5.08
N$117  (via drill 0.76)
  other vias: 62.23,5.08
N$118  (via drill 0.76)
  other vias: 64.77,5.08
N$119  (via drill 0.76)
  other vias: 67.31,5.08
N$120  (via drill 0.76)
  other vias: 69.85,5.08
N$121  (via drill 0.76)
  other vias: 72.39,5.08
N$122  (via drill 0.76)
  other vias: 74.93,5.08
N$123  (via drill 0.76)
  other vias: 77.47,5.08
N$124  (via drill 0.76)
  other vias: 34.29,2.54
N$125  (via drill 0.76)
  other vias: 36.83,2.54
N$126  (via drill 0.76)
  other vias: 39.37,2.54
N$127  (via drill 0.76)
  other vias: 41.91,2.54
N$128  (via drill 0.76)
  other vias: 44.45,2.54
N$129  (via drill 0.76)
  other vias: 46.99,2.54
N$130  (via drill 0.76)
  other vias: 49.53,2.54
N$131  (via drill 0.76)
  other vias: 52.07,2.54
N$132  (via drill 0.76)
  other vias: 54.61,2.54
N$133  (via drill 0.76)
  other vias: 57.15,2.54
N$134  (via drill 0.76)
  other vias: 59.69,2.54
N$135  (via drill 0.76)
  other vias: 62.23,2.54
N$136  (via drill 0.76)
  other vias: 64.77,2.54
N$137  (via drill 0.76)
  other vias: 67.31,2.54
N$138  (via drill 0.76)
  other vias: 69.85,2.54
N$139  (via drill 0.76)
  other vias: 72.39,2.54
N$140  (via drill 0.76)
  other vias: 74.93,2.54
N$141  (via drill 0.76)
  other vias: 77.47,2.54
N$142  (via drill 0.76)
  other vias: 34.29,17.78
N$143  (via drill 0.76)
  other vias: 36.83,17.78
N$144  (via drill 0.76)
  other vias: 39.37,17.78
N$145  (via drill 0.76)
  other vias: 41.91,17.78
N$146  (via drill 0.76)
  other vias: 44.45,17.78
N$147  (via drill 0.76)
  other vias: 46.99,17.78
N$148  (via drill 0.76)
  other vias: 49.53,17.78
N$149  (via drill 0.76)
  other vias: 52.07,17.78
N$150  (via drill 0.76)
  other vias: 54.61,17.78
N$151  (via drill 0.76)
  other vias: 57.15,17.78
N$152  (via drill 0.76)
  other vias: 59.69,17.78
N$153  (via drill 0.76)
  other vias: 62.23,17.78
N$154  (via drill 0.76)
  other vias: 64.77,17.78
N$155  (via drill 0.76)
  other vias: 67.31,17.78
N$156  (via drill 0.76)
  other vias: 69.85,17.78
N$157  (via drill 0.76)
  other vias: 72.39,17.78
N$158  (via drill 0.76)
  other vias: 74.93,17.78
N$159  (via drill 0.76)
  other vias: 77.47,17.78
N$160
  Bottom 0.254: PAPILIO_.B17 97.79,54.61 101.85,58.67 108.33,58.67 110.49,56.52 $$U$2.7
N$161
  Bottom 0.254: PAPILIO_.B18 91.44,52.07 94.49,49.02 107.44,49.02 $$U$2.6
N$162
  Bottom 0.254: PAPILIO_.B19 90.17,49.53 91.44,48.26 109.22,48.26 $$U$2.5
N$163
  Top 0.254: PAPILIO_.B20 $$U$2.4
N$164
  Top 0.254: $$U$2.3 91.44,44.45 90.17,45.72 86.36,45.72 PAPILIO_.B21
N$165
  Top 0.254: $$U$2.2 91.44,41.91 90.17,43.18 86.36,43.18 PAPILIO_.B22
N$166
  Top 0.254: $$U$2.1 91.44,39.37 90.17,40.64 86.36,40.64 PAPILIO_.B23
N$167
  Top 0.254: $$U$2.0 91.44,36.83 90.17,38.1 86.36,38.1 PAPILIO_.B24
N$168
  Top 0.254: PAPILIO_.B25 U$3.7
N$169
  Top 0.254: PAPILIO_.B26 U$3.6
N$170
  Top 0.254: PAPILIO_.B27 U$3.5
N$171
  Top 0.254: PAPILIO_.B28 U$3.4
N$172
  Bottom 0.254: PAPILIO_.B29 86.36,22.86 96.52,22.86 99.06,25.4 109.22,25.4 U$3.3
N$173
  Top 0.254: PAPILIO_.B30 86.36,22.86 97.28,22.86 99.31,24.89 107.19,24.89 U$3.2
N$174
  Bottom 0.254: PAPILIO_.B31 86.36,17.78 95.25,17.78 96.52,16.51 106.68,16.51 109.22,19.05 U$3.1
N$175
  Bottom 0.254: PAPILIO_.B32 87.63,13.97 107.95,13.97 U$3.0
SD_!CS
  Top 0.254: SD1.2 10.39,12.93 13.97,16.51 25.4,16.51 27.94,19.05 27.94,20.32 PAPILIO_.A46
SD_DI
  Top 0.254: SD1.3 6.41,14.03 17.02,24.64 28.7,24.64 PAPILIO_.A45
SD_DO
  Top 0.254: SD1.7 7,18.43 16.51,27.94 27.94,27.94 PAPILIO_.A43
SD_SCK
  Top 0.254: PAPILIO_.A44 27.94,25.4 25.4,25.4 24.41,26.39 16.23,26.39 6.07,16.23 SD1.5
WS2_2V5
  Bottom 0.406: PAPILIO_.W2_2V5_4 96.52,19.05 97.79,17.78 106.68,17.78 109.22,20.32 111.76,20.32 U$3.2V5@2
WS2_3V3
  Bottom 0.406: PAPILIO_.W2_3V3_4 95.5,21.59 98.3,18.8 105.16,18.8 109.22,22.86 111.76,22.86 U$3.3V3@2
WS2_5V0
  Bottom 0.406: PAPILIO_.W2_5V_4 96.52,24.13 98.55,26.16 107.44,26.16 109.22,27.94 111.76,27.94 113.03,26.67 U$3.5V@2
WS2_GND
  Bottom 0.406: PAPILIO_.W2_GND_4 88.9,16.51 90.17,15.24 106.68,15.24 109.22,17.78 111.76,17.78 U$3.GND@2
WS_2V5
  Bottom 0.406: PAPILIO_.W2_2V5_2 106.68,39.37 107.95,40.64 111.76,40.64 $$U$2.2V5@2
WS_3V3
  Bottom 0.406: PAPILIO_.W2_3V3_2 106.68,41.91 107.95,43.18 111.76,43.18 $$U$2.3V3@2
WS_5V0
  Bottom 0.406: PAPILIO_.W2_5V_2 106.68,44.45 107.95,45.72 111.76,45.72 $$U$2.5V@2
WS_GND
  Bottom 0.406: PAPILIO_.W2_GND_2 106.68,36.83 107.95,38.1 111.76,38.1 $$U$2.GND@2

### Text on the board
tPlace: 8/20/2012 | GND | MIDI IN | MIDI OUT | MIDI THROUGH | SIG | 5V | 15 | A1 | A2 | 14 | LCD | 13 | 12 | 11 | 10 | ANALOG | 9 | 8 | 7 | 6 | 5 | 4 | 3 | 2 | 1 | 0 | RetroCade MegaWing V1.1 | uSD Card | www.gadgetfactory.net | (c) GadgetFactory LLC | Joystick | Papilio Platform | BPM7004
bPlace: www.gadgetfactory.net | (c) GadgetFactory LLC | Papilio Platform